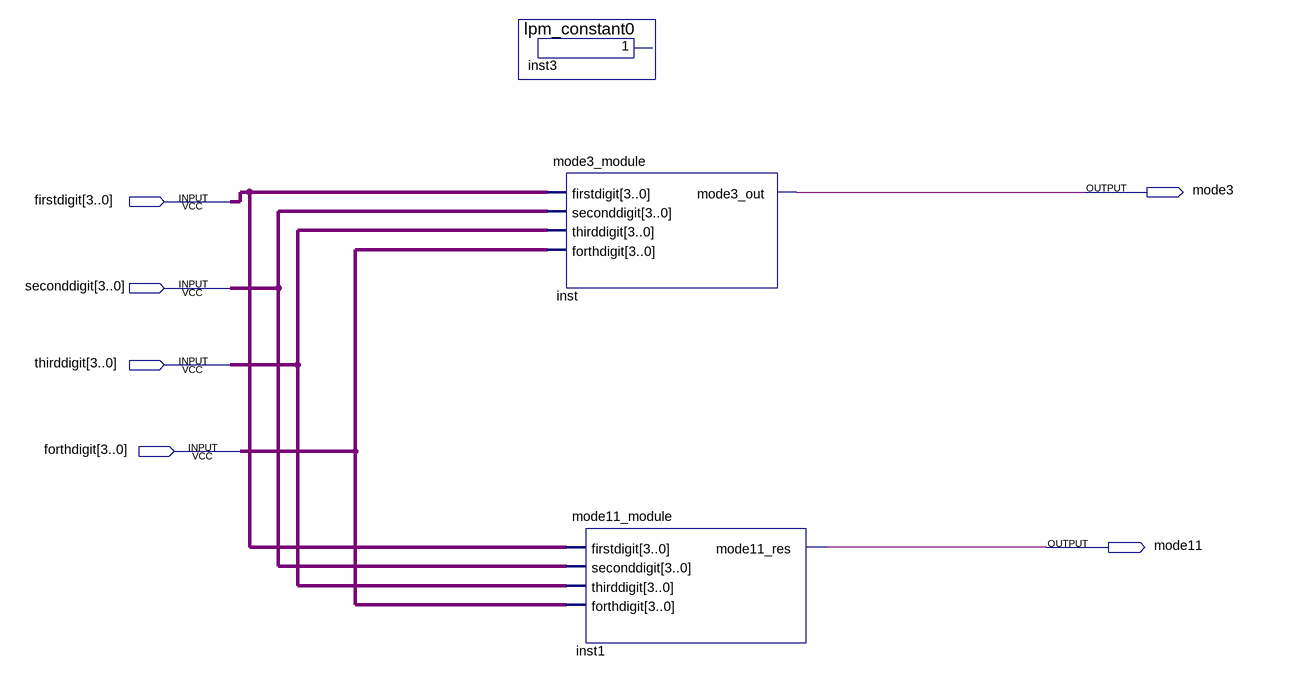
[diagram p0: schematic sheet]
// Quartus schematic recognizer.bdf as structural Verilog: 3 symbols, 6 pins
module recognizer (
  input  [3:0] firstdigit,
  input  [3:0] seconddigit,
  input  [3:0] thirddigit,
  input  [3:0] forthdigit,
  output mode3,
  output mode11
);

  lpm_constant0 inst3 ();  // open: result
  mode3_module inst (
    .firstdigit(firstdigit), .seconddigit(seconddigit), .thirddigit(thirddigit), .forthdigit(forthdigit),
    .mode3_out(mode3));
  mode11_module inst1 (
    .firstdigit(firstdigit), .seconddigit(seconddigit), .thirddigit(thirddigit), .forthdigit(forthdigit),
    .mode11_res(mode11));
endmodule
